# Altium schematic sheet uMultimeter_PROBE_Sch.SchDoc: MicroMultimeter - Probe
size 127 x 101 mm; Author: Hom; CompanyName: KitSprout; DrawnBy: Hom; Engineer: Hom; Organization: KitSprout; Revision: B; SheetNumber: 1; SheetTotal: 1; License: CC BY-SA 4.0; Version: 2.0; LibVersion: 2.1; PageSetup: Record=PageOptions|CenterHorizontal=True|CenterVertical=True|PrintScale=1.00|XCorrection=1.00|YCorrection=1.00|PrintKind=0|BorderSize=5000000|LeftOffset=0|BottomOffset=0|Orientation=2|PaperLength=1000|PaperWidth=1000|Scale=100|PaperSource=7|PrintQuality=-3|MediaType=1|DitherType=10|PrintScaleMode=0|PaperKind=A4|PaperIndex=9
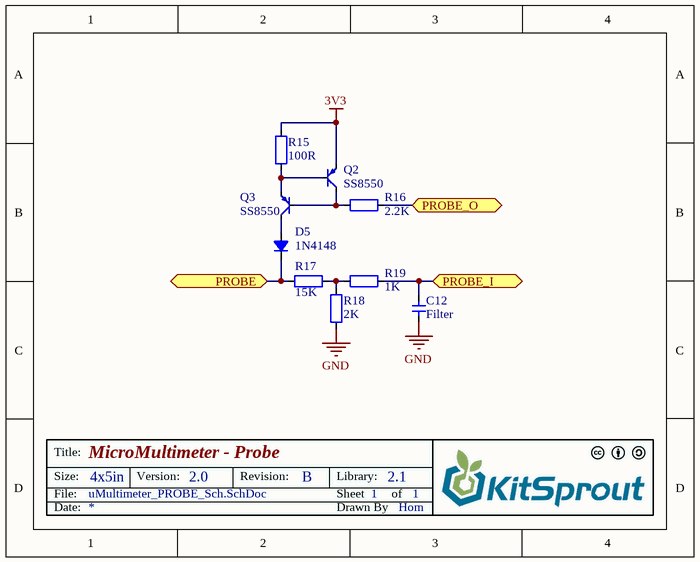
[diagram p0: uMultimeter_PROBE_Sch.SchDoc]

## Parts
C12  value Filter  [CAP_0603]  (hidden comment: Cap_0603)
D5  value 1N4148  [SOD-323]  (hidden comment: Diode_SOD323)
Q2  value SS8550  [SOT23-3]  (hidden comment: BJT_PNP)
Q3  value SS8550  [SOT23-3]  (hidden comment: BJT_PNP)
R15  value 100R  [RES_0603]  (hidden comment: Res_0603)
R16  value 2.2K  [RES_0603]  (hidden comment: Res_0603)
R17  value 15K  [RES_0603]  (hidden comment: Res_0603)
R18  value 2K  [RES_0603]  (hidden comment: Res_0603)
R19  value 1K  [RES_0603]  (hidden comment: Res_0603)

## Ports
PROBE, PROBE_I, PROBE_O

## Nets
3V3: Q2.2(E) R15.2
GND: C12.1 R18.2
PROBE: D5.2(K) R17.2 ; port PROBE
PROBE_I: C12.2 R19.2 ; port PROBE_I
PROBE_O: R16.1 ; port PROBE_O
NetD5_1: D5.1(A) Q3.3(C)
NetQ2_1: Q2.1(B) Q3.2(E) R15.1
NetQ2_3: Q2.3(C) Q3.1(B) R16.2
NetR17_1: R17.1 R18.1 R19.1

## Notes on the sheet
- Title:
- Size:
- Date:
- File:
- 4x5in
- Version:
- Revision:
- Sheet
- Drawn By
- Library:
- of

## Library data of the parts
C12 = Cap_0603: Capacitor
D5 = Diode_SOD323: Diode
Q2 Q3 = BJT_PNP: Transistor
R15-R19 = Res_0603: Resistor